# Altium schematic sheet can.SchDoc
size A4; Organization: UNSW Solar Racing Team; Address3: UNSW; Address4: Sydney NSW 2052; Address2: Electrical Engineering; Address1: Room 342
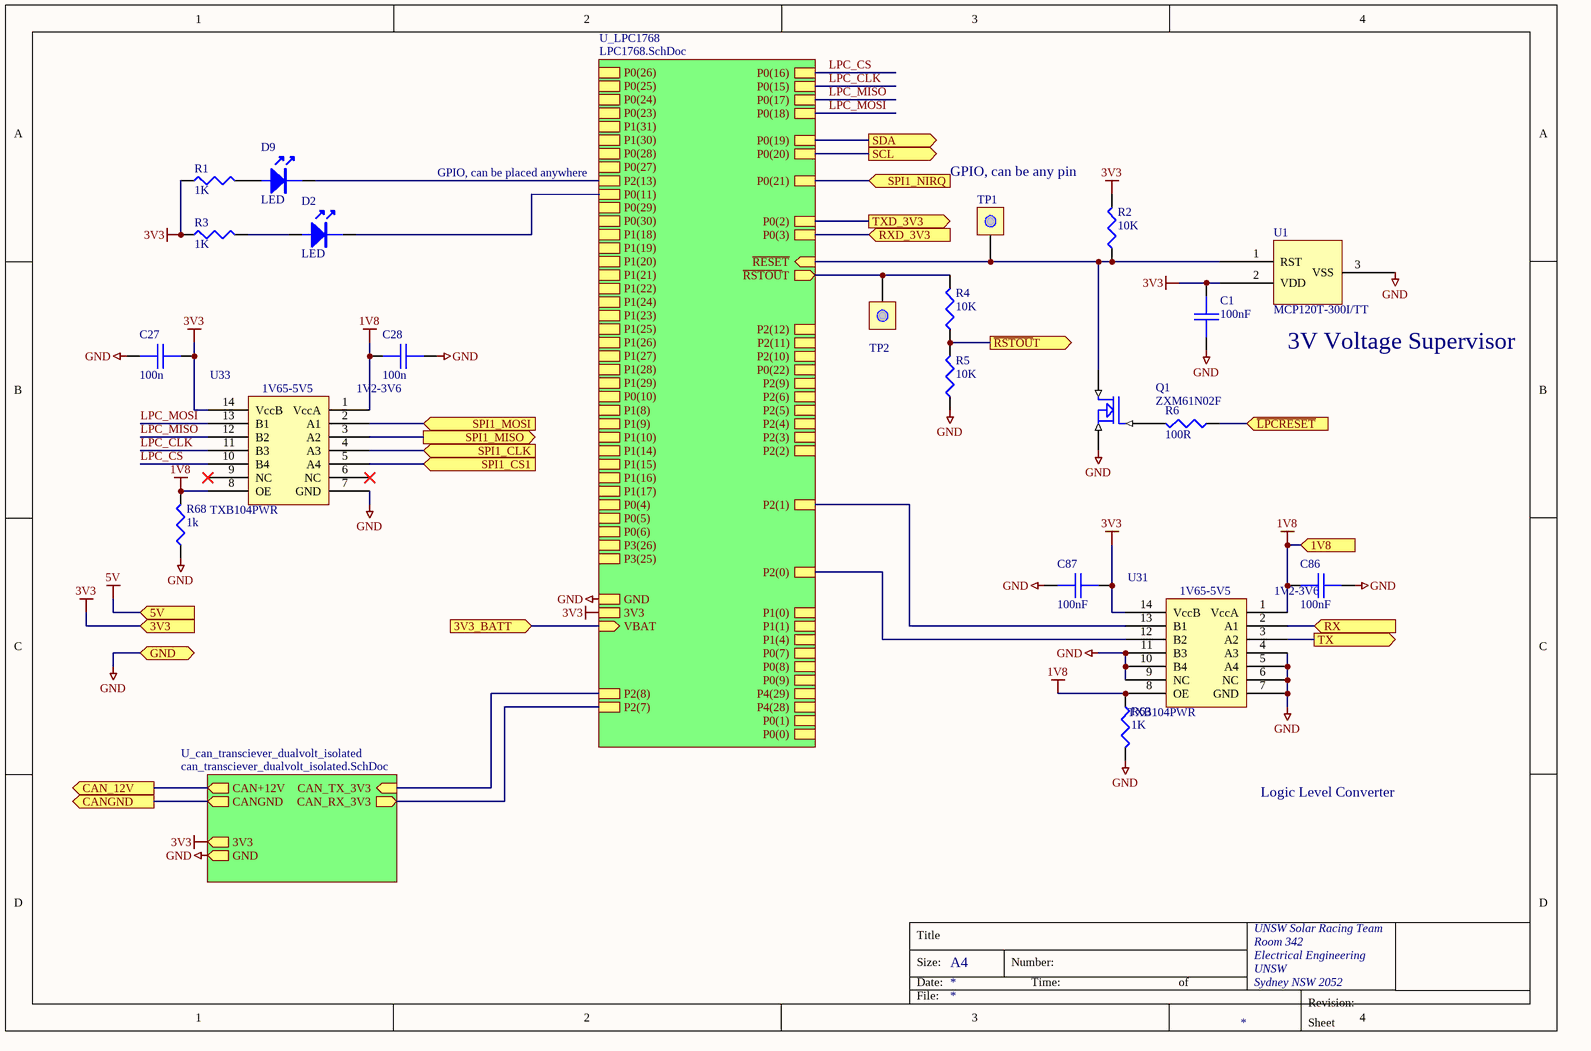
[diagram p0: can.SchDoc]

## Parts
C1  100nF  [0603]
C27  100n  [0603]
C28  100n  [0603]
C86  100nF  [0603]
C87  100nF  [0603]
D2  LED  [0805LED]
D9  LED  [0805LED]
Q1  ZXM61N02F  [SOT23-3]
R1  1K  [0603]
R2  10K  [0603]
R3  1K  [0603]
R4  10K  [0603]
R5  10K  [0603]
R6  100R  [0603]
R63  1K  [0603]
R68  1k  [0603]
TP1  RESET  [TESTPOINT]  (value not drawn)
TP2  RSTOUT  [TESTPOINT]  (value not drawn)
U1  MCP120T-300I/TT  [SOT23-3]
U31  TXB104PWR  [TSSOP14-L]
U33  TXB104PWR  [TSSOP14-L]

## Sub-sheets
U_can_transciever_dualvolt_isolated = can_transciever_dualvolt_isolated.SchDoc: CAN+12V (out), CANGND (out), GND (out), 3V3 (out), CAN_RX_3V3 (out), CAN_TX_3V3 (in)
U_LPC1768 = LPC1768.SchDoc: P0(26), P0(25), P0(24), P0(23), P1(31), P1(30), P0(28), P0(27), P3(26), P3(25), P0(29), P0(30), P1(18), P1(19), P1(20), P1(21), P1(22), P1(24), P1(23), P1(25), P1(26), P1(27), P1(28), P1(29), P0(0), P0(1), P0(10), P0(11), P2(13), P2(12), P2(11), P2(10), P0(22), P0(21), P0(20), P0(19), P0(18), P0(17), P0(15), P0(16), P2(9), P2(8), P2(7), P2(6), P2(5), P2(4), P2(3), P2(2), P2(1), P2(0), P0(2), P0(3), P1(0), P1(1), P1(4), P1(8), P1(9), P1(10), P1(14), P1(15), P1(16), P1(17), P0(4), P0(5), P0(6), P0(7), P0(8), P0(9), P4(29), P4(28), GND, 3V3, ~{RSTOU}T (out), ~{RESET} (in), VBAT (in)

## Ports
1V8 (in), 3V3 (in), 3V3_BATT (in), 5V (in), CAN_12V (out), CANGND (out), GND, RX (in), RXD_3V3 (in), SCL (out), SDA (out), SPI1_CLK (in), SPI1_CS1 (in), SPI1_MISO (out), SPI1_MOSI (in), SPI1_NIRQ (in), TX (out), TXD_3V3 (out), ~{LPCRESET} (in), ~{RSTOU}T (out)

## Nets
1V8: C28.1 C86.2 R63.2 R68.2 U31.1(VccA) U31.8(OE) U33.1(VccA) U33.8(OE) ; port 1V8
3V3: C1.1 C27.2 C87.1 R1.1 R2.2 R3.1 U1.2(VDD) U31.14(VccB) U33.14(VccB) ; port 3V3, sheet U_LPC1768/3V3, sheet U_can_transciever_dualvolt_isolated/3V3
5V: port 5V
GND: C1.2 C27.1 C28.2 C86.1 C87.2 Q1.2(S) R5.1 R63.1 R68.1 U1.3(VSS) U31.4(A3) U31.5(A4) U31.6(NC) U31.7(GND) U31.9(NC) U31.10(B4) U31.11(B3) U33.7(GND) ; port GND, sheet U_LPC1768/GND, sheet U_can_transciever_dualvolt_isolated/GND
3V3_BATT: port 3V3_BATT, sheet U_LPC1768/VBAT
CAN_12V: port CAN_12V, sheet U_can_transciever_dualvolt_isolated/CAN+12V
CANGND: port CANGND, sheet U_can_transciever_dualvolt_isolated/CANGND
~{LPCRESET}: R6.2 ; port ~{LPCRESET}
LPC_CLK: U33.11(B3) ; sheet U_LPC1768/P0(15)
LPC_CS: U33.10(B4) ; sheet U_LPC1768/P0(16)
LPC_MISO: U33.12(B2) ; sheet U_LPC1768/P0(17)
LPC_MOSI: U33.13(B1) ; sheet U_LPC1768/P0(18)
~{RSTOU}T: R4.1 R5.2 ; port ~{RSTOU}T
RX: U31.2(A1) ; port RX
RXD_3V3: port RXD_3V3, sheet U_LPC1768/P0(3)
SCL: port SCL, sheet U_LPC1768/P0(20)
SDA: port SDA, sheet U_LPC1768/P0(19)
SPI1_CLK: U33.4(A3) ; port SPI1_CLK
SPI1_CS1: U33.5(A4) ; port SPI1_CS1
SPI1_MISO: U33.3(A2) ; port SPI1_MISO
SPI1_MOSI: U33.2(A1) ; port SPI1_MOSI
SPI1_NIRQ: port SPI1_NIRQ, sheet U_LPC1768/P0(21)
TX: U31.3(A2) ; port TX
TXD_3V3: port TXD_3V3, sheet U_LPC1768/P0(2)
NetD2_A: D2.A R3.2
NetD2_K: D2.K ; sheet U_LPC1768/P0(11)
NetD9_A: D9.A R1.2
NetD9_K: D9.K ; sheet U_LPC1768/P2(13)
NetQ1_1: Q1.1(G) R6.1
NetQ1_3: Q1.3(D) R2.1 TP1.0(TP) U1.1(RST) ; sheet U_LPC1768/~{RESET}
NetR4_2: R4.2 TP2.0(TP) ; sheet U_LPC1768/~{RSTOU}T
NetU31_12: U31.12(B2) ; sheet U_LPC1768/P2(0)
NetU31_13: U31.13(B1) ; sheet U_LPC1768/P2(1)
(unnamed): sheet U_LPC1768/P2(8), sheet U_can_transciever_dualvolt_isolated/CAN_TX_3V3
(unnamed): sheet U_LPC1768/P2(7), sheet U_can_transciever_dualvolt_isolated/CAN_RX_3V3

Not connected (* = marked no-connect by the designer): U33 6(NC)* 9(NC)*

## Notes on the sheet
- GPIO, can be placed anywhere
- GPIO, can be any pin
- (near U1) 3V Voltage Supervisor
- (near R63) Logic Level Converter
- Title
- Size:
- Date:
- A4
- Number:
- Time:
- of
- File:
- Revision:
- Sheet
- (in symbol TXB0104PWR) 1V65-5V5; 1V2-3V6

## Library data of the parts
C1 C27 C28 C86 C87 = CAP: Capacitor
Q1 = ZXM61N02F: 1.7A, 20V N-Channel Enhancement mode FET; Digikey: ZXM61N02FCT-ND; DigikeyPrice: 0.66; Farnell: 9525270; FarnellPrice: 1.35
R1-R5 = RES1: Resistor; Order#: 9331697; Supplier: Farnell; Price: 0.05
R6 R63 R68 = RES1: Resistor
TP1 TP2 = TEST: TEST POINT
U1 = MCP120T: Voltage Supervisor; Farnell: 1292233; FarnellPrice: 0.951; Digikey: MCP120T-300I/TTCT-ND; DigikeyPrice: 0.54
U31 U33 = TXB0104PWR: 4 bit bidirectional auto direction sense level translator; Digikey: 296-21929-1-ND
  U31: Farnell: 1607891; FarnellPrice: 3.1; DigikeyPrice: 1.93
D2 D9 = LED: DigikeyPrice: 0.21
  D2: Digikey: 475-2676-1-ND
  D9: Farnell: *; Digikey: 475-2690-1-ND